# EAGLE schematic Barnabas botV2 (EAGLE 7.6.0)
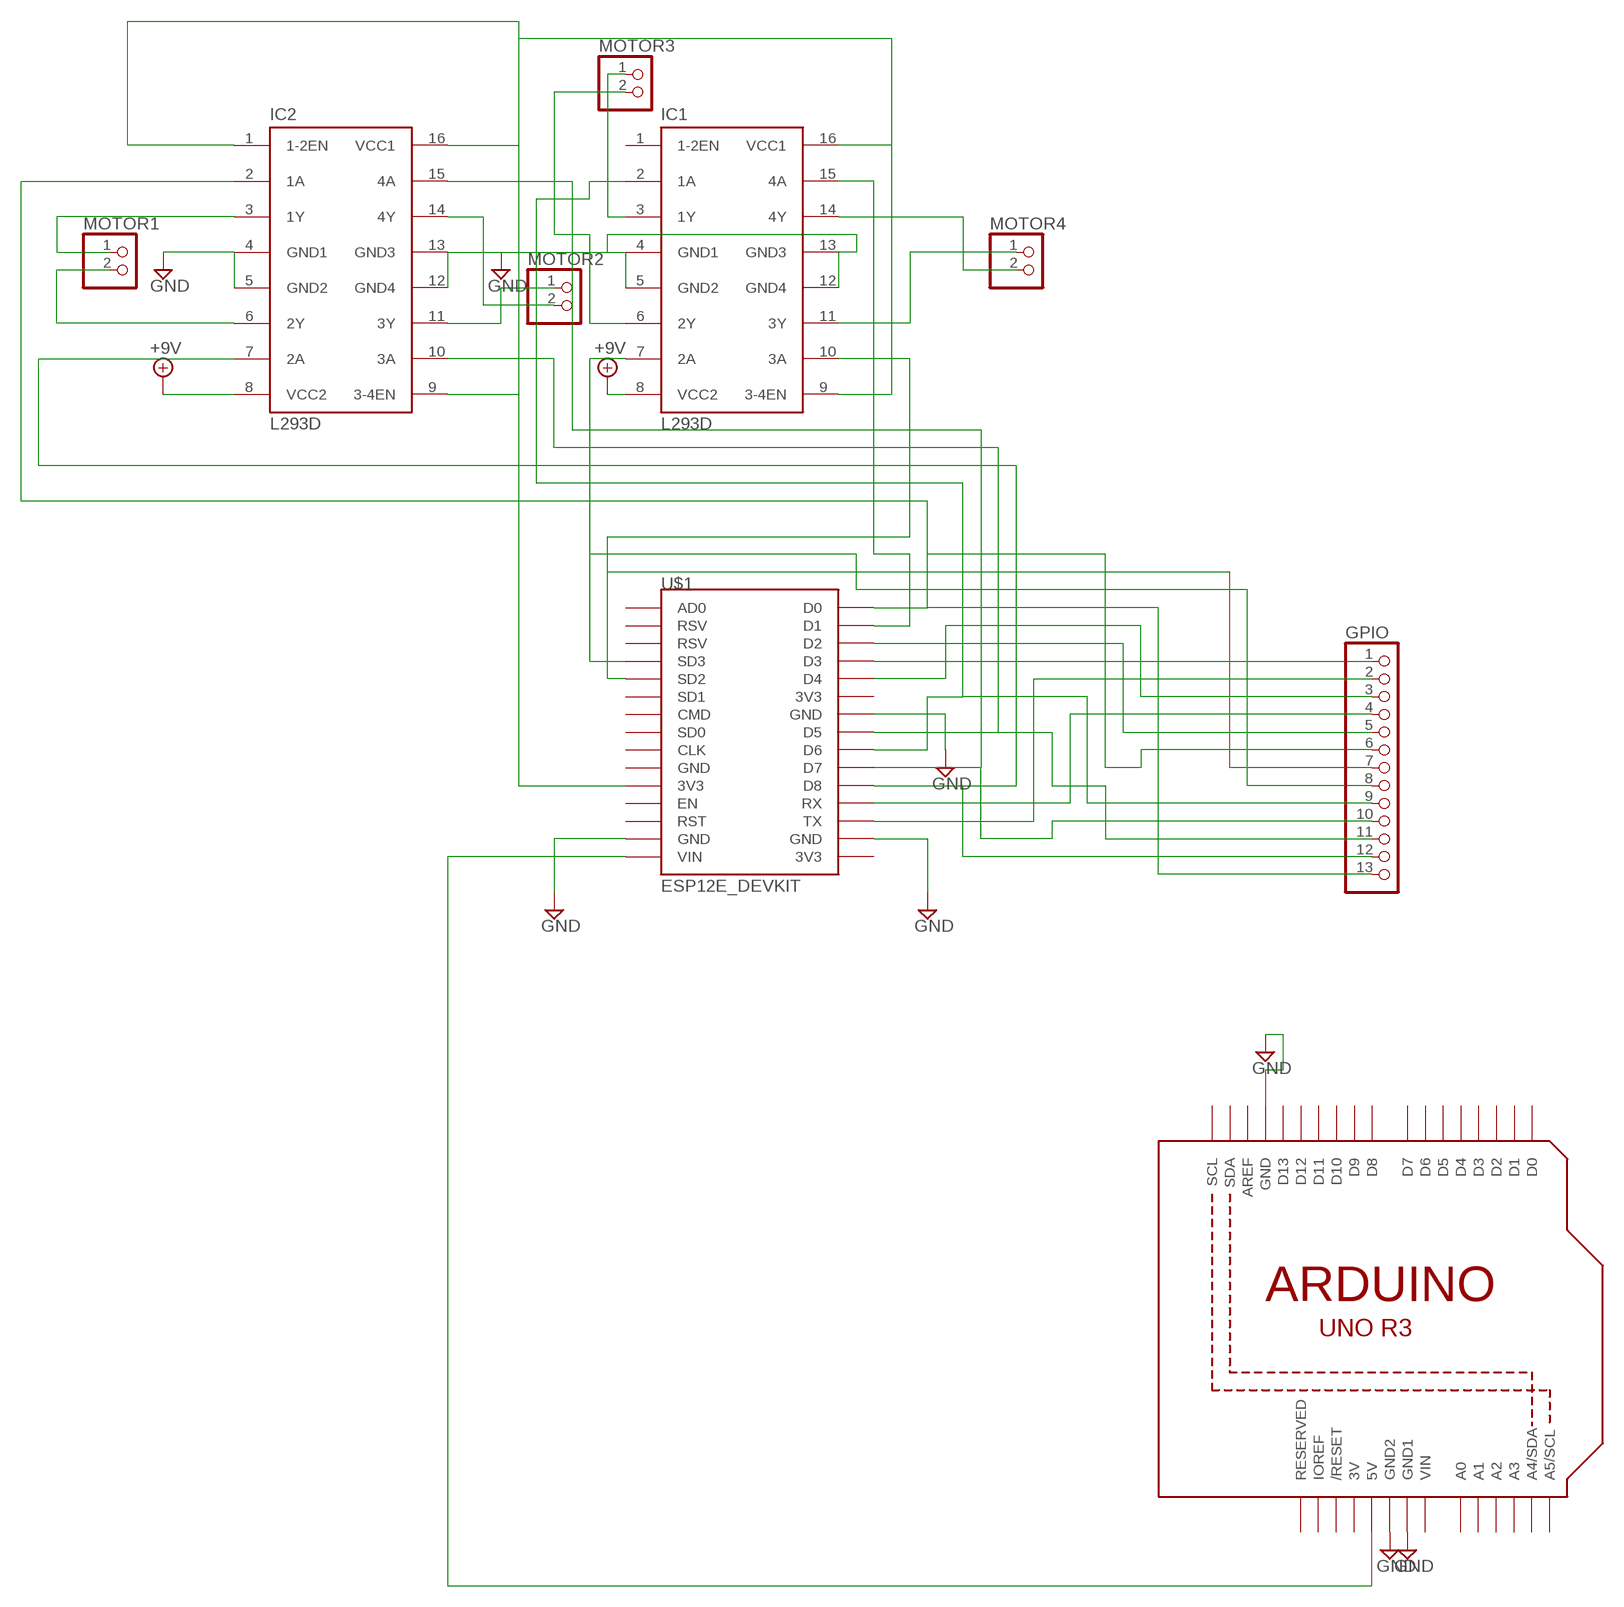
[diagram p0: schematic, sheet 1]

## Parts
GPIO  PINHD-1X13  [1X13]
IC1  L293D  [DIL16]
IC2  L293D  [DIL16]
MOTOR1  PINHD-1X2  [1X02]
MOTOR2  PINHD-1X2  [1X02]
MOTOR3  PINHD-1X2  [1X02]
MOTOR4  PINHD-1X2  [1X02]
U1  ARDUINOR3-DIMENSION  [ARDUINOR3]
U$1  ESP12E_DEVKIT  [ESP12E_DEVKIT]

## Nets
+9V: IC1.8(VCC2) IC2.8(VCC2)
GND: IC1.4(GND1) IC1.5(GND2) IC1.12(GND4) IC1.13(GND3) IC2.4(GND1) IC2.5(GND2) IC2.12(GND4) IC2.13(GND3) U1.GND U1.GND1 U1.GND2 U$1.GND@1(GND) U$1.GND@2(GND) U$1.GND@3(GND)
N$1: GPIO.1 U$1.D3
N$2: GPIO.12 IC2.7(2A) U$1.D8
N$3: IC1.9(3-4EN) IC1.16(VCC1) IC2.1(1-2EN) IC2.9(3-4EN) IC2.16(VCC1) U$1.3V3@0(3V3)
N$5: GPIO.11 IC2.10(3A) U$1.D5
N$6: GPIO.10 IC2.15(4A) U$1.D7
N$7: GPIO.9 IC1.2(1A) U$1.D6
N$8: GPIO.8 IC1.7(2A) U$1.SD3
N$9: GPIO.7 IC1.10(3A) U$1.SD2
N$10: IC1.15(4A) U$1.D1
N$11: IC2.3(1Y) MOTOR1.1
N$12: IC2.6(2Y) MOTOR1.2
N$13: IC2.11(3Y) MOTOR2.1
N$14: IC2.14(4Y) MOTOR2.2
N$15: IC1.3(1Y) MOTOR3.1
N$16: IC1.6(2Y)
N$17: IC1.14(4Y) MOTOR4.2
N$18: IC1.11(3Y) MOTOR4.1
N$19: GPIO.2 U$1.TX
N$20: U1.5V U$1.VIN
N$21: GPIO.3 U$1.D4
N$22: GPIO.4 U$1.RX
N$23: GPIO.5 U$1.D2
N$24: GPIO.6 GPIO.13 IC2.2(1A) U$1.D0
N$25: MOTOR3.2
Unconnected: IC1.1(1-2EN) U1.A0 U1.A1 U1.A2 U1.A3 U1.A4(A4/SDA) U1.A5(A5/SCL) U1.AREF U1.D0 U1.D1 U1.D2 U1.D3 U1.D4 U1.D5 U1.D6 U1.D7 U1.D8 U1.D9 U1.D10 U1.D11 U1.D12 U1.D13 U1.IOREF U1.RESERVED U1.RESET(/RESET) U1.SCL U1.SDA U$1.3V3@1(3V3) U$1.3V3@2(3V3) U$1.AD0 U$1.CLK U$1.CMD U$1.EN U$1.GND@0(GND) U$1.RST U$1.RSV@0(RSV) U$1.RSV@1(RSV) U$1.SD0 U$1.SD1

## Power pins joined to a net without a drawn wire
3V: U1.3V
VIN: U1.VIN

## Library data of the parts
GPIO = pinhead:PINHD-1X13: PIN HEADER
IC1 IC2 = st-microelectronics:L293D: PUSH-PULL 4 CHANNEL DRIVER; MPN: L293D; OC_FARNELL: 9589619; OC_NEWARK: 56P8249
MOTOR1-MOTOR4 = pinhead:PINHD-1X2: PIN HEADER
U1 = adafruit:ARDUINOR3: This is a new object for the new Arduino R3 - with extra pins that you may want to use (such as IOref, and duplicated A4/A5
U$1 = ESP12E_DEVKIT:ESP12E_DEVKIT: ESP12E DEVKIT BOARD